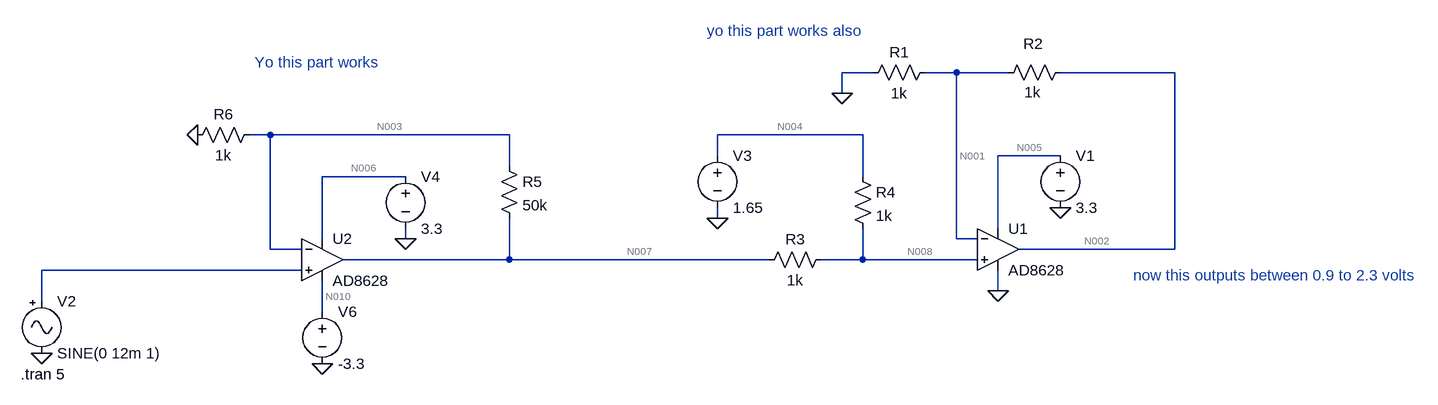
[diagram p0: schematic Level_shifter_opamp_amplified.asc]
Level_shifter_opamp_amplified.asc, the LTspice schematic file:
Version 4
SHEET 1 1396 680
WIRE -48 -192 -96 -192
WIRE 80 -192 32 -192
WIRE 160 -192 80 -192
WIRE 416 -192 240 -192
WIRE -96 -160 -96 -192
WIRE -976 -96 -1008 -96
WIRE -608 -96 -976 -96
WIRE -64 -96 -288 -96
WIRE -288 -64 -288 -96
WIRE 240 -64 144 -64
WIRE -608 -48 -608 -96
WIRE -768 -32 -896 -32
WIRE -64 -32 -64 -96
WIRE -288 32 -288 16
WIRE 144 48 144 -64
WIRE -896 64 -896 -32
WIRE -768 64 -768 48
WIRE 80 64 80 -192
WIRE 112 64 80 64
WIRE -976 80 -976 -96
WIRE -928 80 -976 80
WIRE 416 80 416 -192
WIRE 416 80 176 80
WIRE -608 96 -608 32
WIRE -608 96 -864 96
WIRE -208 96 -608 96
WIRE -64 96 -64 48
WIRE -64 96 -128 96
WIRE 112 96 -64 96
WIRE -928 112 -1328 112
WIRE 144 144 144 112
WIRE -1328 160 -1328 112
WIRE -896 176 -896 128
FLAG 144 144 0
FLAG 240 16 0
FLAG -288 32 0
FLAG -96 -160 0
FLAG -768 64 0
FLAG -1328 240 0
FLAG -1088 -96 0
FLAG -896 256 0
SYMBOL Opamps\\AD8628 144 16 R0
SYMATTR InstName U1
SYMBOL voltage 240 -80 R0
WINDOW 123 0 0 Left 0
WINDOW 39 0 0 Left 0
SYMATTR InstName V1
SYMATTR Value 3.3
SYMBOL res 256 -208 R90
WINDOW 0 -13 58 VBottom 2
WINDOW 3 31 59 VTop 2
SYMATTR InstName R2
SYMATTR Value 1k
SYMBOL voltage -288 -80 R0
WINDOW 123 0 0 Left 0
WINDOW 39 0 0 Left 0
SYMATTR InstName V3
SYMATTR Value 1.65
SYMBOL res 48 -208 R90
WINDOW 0 0 56 VBottom 2
WINDOW 3 32 56 VTop 2
SYMATTR InstName R1
SYMATTR Value 1k
SYMBOL Opamps\\AD8628 -896 32 R0
SYMATTR InstName U2
SYMBOL voltage -768 -48 R0
WINDOW 123 0 0 Left 0
WINDOW 39 0 0 Left 0
SYMATTR InstName V4
SYMATTR Value 3.3
SYMBOL Misc\\signal -1328 144 R0
WINDOW 123 0 0 Left 0
WINDOW 39 0 0 Left 0
SYMATTR InstName V2
SYMATTR Value SINE(0 12m 1)
SYMBOL res -624 -64 R0
SYMATTR InstName R5
SYMATTR Value 50k
SYMBOL res -992 -112 R90
WINDOW 0 0 56 VBottom 2
WINDOW 3 32 56 VTop 2
SYMATTR InstName R6
SYMATTR Value 1k
SYMBOL voltage -896 160 R0
WINDOW 123 0 0 Left 0
WINDOW 39 0 0 Left 0
SYMATTR InstName V6
SYMATTR Value -3.3
SYMBOL res -80 -48 R0
SYMATTR InstName R4
SYMATTR Value 1k
SYMBOL res -112 80 R90
WINDOW 0 0 56 VBottom 2
WINDOW 3 32 56 VTop 2
SYMATTR InstName R3
SYMATTR Value 1k
TEXT -304 -256 Left 2 ;yo this part works also
TEXT -1360 272 Left 2 !.tran 5
TEXT -1000 -208 Left 2 ;Yo this part works
TEXT 352 120 Left 2 ;now this outputs between 0.9 to 2.3 volts

The netlist it stands for:
* Level_shifter_opamp_amplified.asc
XU1 N008 N001 N005 0 N002 AD8628  ; pins In+ In- V+ V- OUT
V1 N005 0 3.3
R2 N002 N001 1k
V3 N004 0 1.65
R1 N001 0 1k
XU2 N009 N003 N006 N010 N007 AD8628  ; pins In+ In- V+ V- OUT
V4 N006 0 3.3
V2 N009 0 SINE(0 12m 1)
R5 N003 N007 50k
R6 N003 0 1k
V6 N010 0 -3.3
R4 N004 N008 1k
R3 N008 N007 1k
* yo this part works also
.tran 5
* Yo this part works
* now this outputs between 0.9 to 2.3 volts
.backanno
.end

* Results of the author's LTspice run, read from the files saved beside the schematic
* Operating Point, zero values left out:
*   V(n001) = 825 mV
*   V(n005) = 3.3 V
*   V(n008) = 825 mV
*   V(n002) = 1.65 V
*   V(n004) = 1.65 V
*   V(n003) = 1.245 µV
*   V(n010) = -3.3 V
*   V(n006) = 3.3 V
*   V(n007) = 62.24 µV
*   I(R3) = 825 µA
*   I(R4) = 825 µA
*   I(R6) = 1.245 nA
*   I(R5) = -1.22 nA
*   I(R1) = 825 µA
*   I(R2) = 825 µA
*   I(V6) = 1.366 mA
*   I(V2) = -25 pA
*   I(V4) = -541 µA
*   I(V3) = -825 µA
*   I(V1) = -1.175 mA
*   Ix(u1:1) = 25 pA
*   Ix(u1:2) = -25 pA
*   Ix(u1:99) = 1.175 mA
*   Ix(u1:50) = -350.3 µA
*   Ix(u1:45) = -825 µA
*   Ix(u2:1) = 25 pA
*   Ix(u2:2) = -25 pA
*   Ix(u2:99) = 541 µA
*   Ix(u2:50) = -1.366 mA
*   Ix(u2:45) = 825 µA
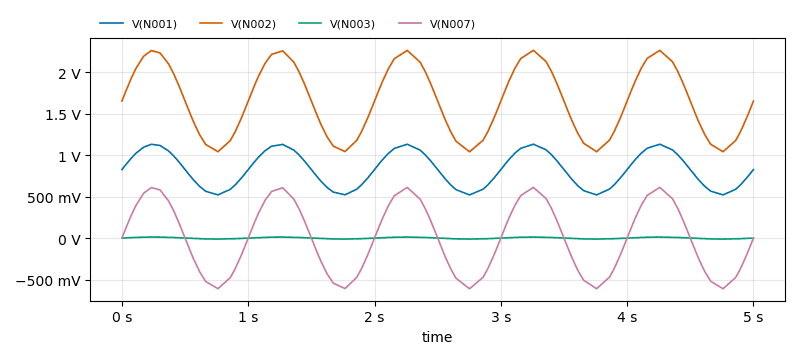
[diagram p1: Transient Analysis of Level_shifter_opamp_amplified.asc, plotted from the saved traces]
* Transient Analysis, 1 run:
*   V(N001): min 519.5 mV, max 1.13 V, average 825.3 mV, rms 852.2 mV, last 825 mV
*   V(N002): min 1.039 V, max 2.261 V, average 1.651 V, rms 1.704 V, last 1.65 V
*   V(N003): min -11.98 mV, max 11.97 mV, average 10.36 µV, rms 8.332 mV, last 991.1 nV
*   V(N007): min -611 mV, max 610.6 mV, average 527.3 µV, rms 424.9 mV, last 49.3 µV